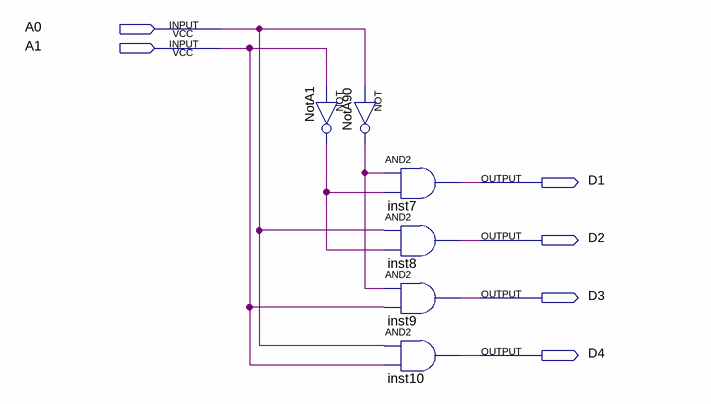
[diagram p0: schematic sheet]
// Quartus schematic Decoder2to4.bdf as structural Verilog: 6 symbols, 6 pins
module Decoder2to4 (
  input  A0,
  input  A1,
  output D1,
  output D2,
  output D3,
  output D4
);

  wire NotA1_out, NotA90_out;

  not NotA1 (NotA1_out, A1);
  not NotA90 (NotA90_out, A0);
  and inst7 (D1, NotA90_out, NotA1_out);
  and inst8 (D2, A0, NotA1_out);
  and inst9 (D3, NotA90_out, A1);
  and inst10 (D4, A0, A1);
endmodule
